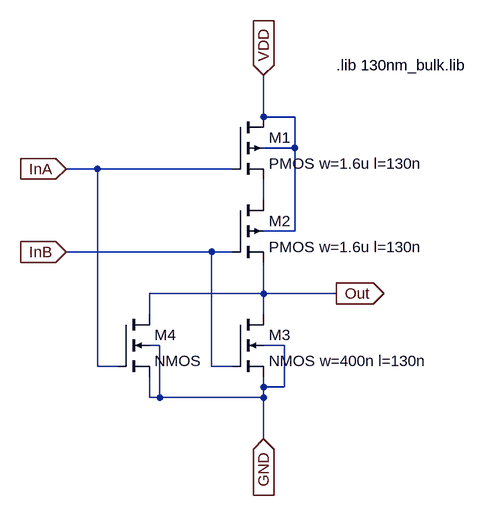
[diagram p0: schematic NOR.asc]
NOR.asc, the LTspice schematic file:
Version 4
SHEET 1 880 680
WIRE 240 16 240 -48
WIRE 288 16 240 16
WIRE 288 64 288 16
WIRE 288 64 240 64
WIRE -16 96 -64 96
WIRE 192 96 -16 96
WIRE 240 144 240 112
WIRE 288 192 288 64
WIRE 288 192 240 192
WIRE 160 224 -64 224
WIRE 192 224 160 224
WIRE 240 288 240 240
WIRE 240 288 64 288
WIRE 352 288 240 288
WIRE 64 320 64 288
WIRE 240 320 240 288
WIRE 80 368 64 368
WIRE 272 368 240 368
WIRE -16 400 -16 96
WIRE 16 400 -16 400
WIRE 160 400 160 224
WIRE 192 400 160 400
WIRE 240 432 240 416
WIRE 272 432 272 368
WIRE 272 432 240 432
WIRE 64 448 64 416
WIRE 80 448 80 368
WIRE 80 448 64 448
WIRE 240 448 240 432
WIRE 240 448 80 448
WIRE 240 512 240 448
FLAG -64 96 InA
IOPIN -64 96 In
FLAG -64 224 InB
IOPIN -64 224 In
FLAG 240 -48 VDD
IOPIN 240 -48 In
FLAG 240 512 GND
IOPIN 240 512 In
FLAG 352 288 Out
IOPIN 352 288 Out
SYMBOL pmos4 192 16 R0
SYMATTR InstName M1
SYMATTR Value2 l=130n w=1.6u
SYMATTR Value PMOS w=1.6u l=130n
SYMBOL pmos4 192 144 R0
SYMATTR InstName M2
SYMATTR Value2 l=130n w=1.6u
SYMATTR Value PMOS w=1.6u l=130n
SYMBOL nmos4 192 320 R0
SYMATTR InstName M3
SYMATTR Value2 l=130n w=400n
SYMATTR Value NMOS w=400n l=130n
SYMBOL nmos4 16 320 R0
SYMATTR InstName M4
SYMATTR Value2 l=130n w=400n
TEXT 352 -64 Left 2 !.lib 130nm_bulk.lib

The netlist it stands for:
* NOR.asc
M1 VDD InA N001 VDD PMOS w=1.6u l=130n l=130n w=1.6u
M2 N001 InB Out VDD PMOS w=1.6u l=130n l=130n w=1.6u
M3 Out InB GND GND NMOS w=400n l=130n l=130n w=400n
M4 Out InA GND GND NMOS l=130n w=400n
.model NMOS NMOS
.model PMOS PMOS
.lib standard.mos
.lib 130nm_bulk.lib
.backanno
.end